# Altium schematic sheet [06] - CONNECTORS.SchDoc
size A4
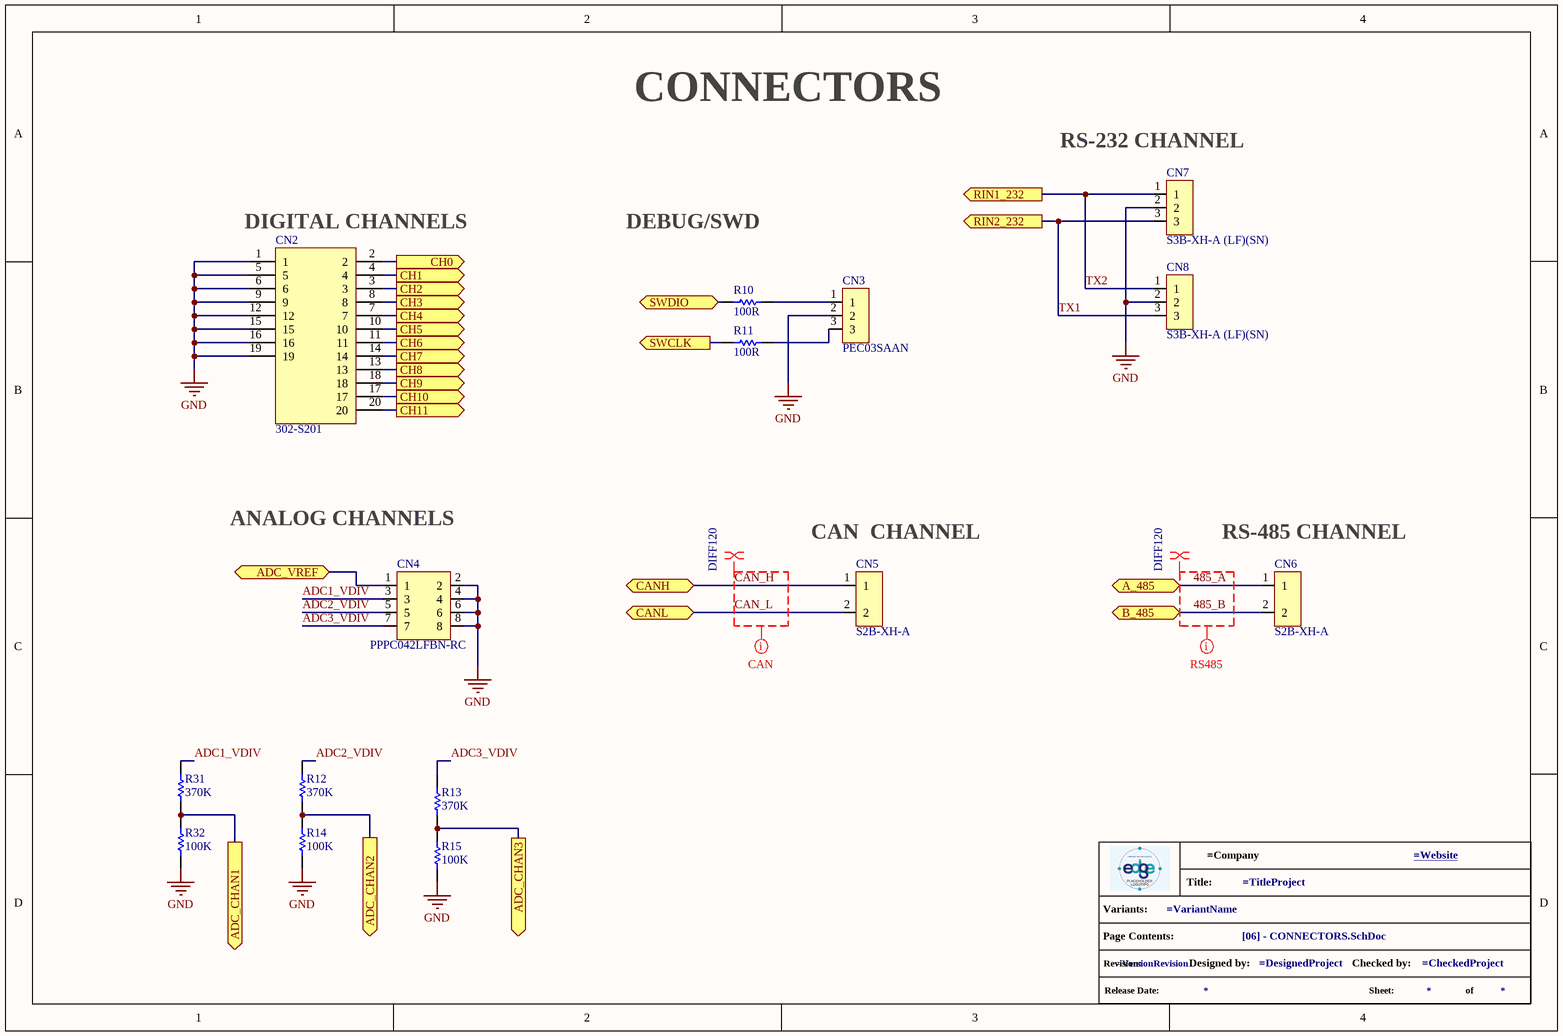
[diagram p0: [06] - CONNECTORS.SchDoc]

## Parts
CN2  302-S201  [SHDR20W66P254_2X10_3300X905X905P]
CN3  PEC03SAAN  [PEC03SAAN]
CN4  PPPC042LFBN-RC  [XPYC042LFBN-RC]
CN5  S2B-XH-A  [S2B-XH-A]
CN6  S2B-XH-A  [S2B-XH-A]
CN7  S3B-XH-A (LF)(SN)  [SHDRRA3W64P0X250_1X3_990X1150X610P]
CN8  S3B-XH-A (LF)(SN)  [SHDRRA3W64P0X250_1X3_990X1150X610P]
GPH?  info_project  (value not drawn)  (graphical)
R10  100R  [R0603]
R11  100R  [R0603]
R12  370K  [R0603]
R13  370K  [R0603]
R14  100K  [R0402]
R15  100K  [R0402]
R31  370K  [R0603]
R32  100K  [R0402]

## Ports
A_485 (bidir), ADC_CHAN1 (out), ADC_CHAN2 (out), ADC_CHAN3 (out), ADC_VREF (bidir), B_485 (bidir), CANH (bidir), CANL (bidir), CH0 (out), CH1 (out), CH2 (out), CH3 (out), CH4 (out), CH5 (out), CH6 (out), CH7 (out), CH8 (out), CH9 (out), CH10 (out), CH11 (out), RIN1_232 (out), RIN2_232 (out), SWCLK (out), SWDIO (bidir)

## Nets
GND: CN2.1 CN2.5 CN2.6 CN2.9 CN2.12 CN2.15 CN2.16 CN2.19 CN3.2 CN4.2 CN4.4 CN4.6 CN4.8 CN7.2 CN8.2 R14.1 R15.2 R32.1
485_A: CN6.1 ; port A_485
485_B: CN6.2 ; port B_485
ADC1_VDIV: CN4.3 R31.2
ADC2_VDIV: CN4.5 R12.2
ADC3_VDIV: CN4.7 R13.2
ADC_CHAN1: R31.1 R32.2 ; port ADC_CHAN1
ADC_CHAN2: R12.1 R14.2 ; port ADC_CHAN2
ADC_CHAN3: R13.1 R15.1 ; port ADC_CHAN3
ADC_VREF: CN4.1 ; port ADC_VREF
CAN_H: CN5.1 ; port CANH
CAN_L: CN5.2 ; port CANL
CH0: CN2.2 ; port CH0
CH1: CN2.4 ; port CH1
CH2: CN2.3 ; port CH2
CH3: CN2.8 ; port CH3
CH4: CN2.7 ; port CH4
CH5: CN2.10 ; port CH5
CH6: CN2.11 ; port CH6
CH7: CN2.14 ; port CH7
CH8: CN2.13 ; port CH8
CH9: CN2.18 ; port CH9
CH10: CN2.17 ; port CH10
CH11: CN2.20 ; port CH11
SWCLK: R11.1 ; port SWCLK
SWDIO: R10.1 ; port SWDIO
TX1: CN7.3 CN8.3 ; port RIN2_232
TX2: CN7.1 CN8.1 ; port RIN1_232
NetCN3_1: CN3.1 R10.2
NetCN3_3: CN3.3 R11.2

## Layout directives
net class CAN: CAN_H, CAN_L
differential pair; differential pair class DIFF120: 485_A, 485_B, CAN_H, CAN_L
net class RS485: 485_A, 485_B

## Notes on the sheet
- CONNECTORS
- (near CN7) RS-232 CHANNEL
- (near CN2) DIGITAL CHANNELS
- DEBUG/SWD
- ANALOG CHANNELS
- (near CN5) CAN  CHANNEL
- (near CN6) RS-485 CHANNEL
- (in symbol info_project) Title:; Variants:; Page Contents:; Revision:; Designed by:; Checked by:; Release Date:; Sheet:; of

## Library data of the parts
CN2 = 302-S201: CONN - Connector Header Through Hole 20 position 0.100" (2.54mm); Manufacturer 1: On Shore Technology Inc.; Description: Conn Shrouded Header HDR 20 POS 2.54mm Solder ST Thru-Hole; .Mounting: PTH; Datasheet Link: https://www.on-shore.com/wp-content/uploads/2018/04/302-SXX1.pdf; Height: 9.05mm; Arrow Part Number: 302-S201; Arrow Price/Stock: https://www.arrow.com/en/products/302-s201/on-shore-technology?region=nac; Manufacturer Part Number 1: 302-S201; .SCHChecked: *; .PCBChecked: *
CN3 = PEC03SAAN: CONN - 3 Position connector Header Through Hole  0.100" (2.54mm); Manufacturer 1: Sullins; .Mounting: PTH; Datasheet Link: https://s3.amazonaws.com/catalogspreads-pdf/PAGE112-113%20.100%20MALE%20HDR.pdf; Height: 8.38mm; .PCBChecked: *; .SCHChecked: *; Manufacturer Part Number 1: PEC03SAAN
CN4 = PPPC042LFBN-RC: CONN - 8 Position Header Connector 0.100" (2.54mm) Through Hole Gold; Manufacturer 1: Sullins; .Mounting: PTH; Datasheet Link: https://drawings-pdf.s3.amazonaws.com/10492.pdf; Height: 8.7mm; Manufacturer Part Number 1: PPPC042LFBN-RC; .SCHChecked: *; .PCBChecked: *
CN5 CN6 = S2B-XH-A: CONN - Connector Header Through Hole, Right Angle 2 position 0.098" (2.50mm); Manufacturer 1: JST (JAPAN SOLDERLESS TERMINALS); Manufacturer Part Number 1: S2B-XH-A-1(LF)(SN); .Mounting: PTH; Datasheet Link: http://www.jst-mfg.com/product/pdf/eng/eXH.pdf; Height: 6.1mm; Mouser Part Number: 306-S2BXHA1LFSN; Mouser Price/Stock: https://www.mouser.co.uk/ProductDetail/JST-Commercial/S2B-XH-A-1LFSN?qs=QpmGXVUTftHhNeC%252BPQWeTw%3D%3D; .PCBChecked: *; .SCHChecked: *
CN7 CN8 = S3B-XH-A (LF)(SN): CONN - Connector Header Through Hole, Right Angle 3 position 0.098" (2.50mm); Manufacturer 1: JST (JAPAN SOLDERLESS TERMINALS); .Mounting: PTH; Datasheet Link: http://www.farnell.com/datasheets/2057209.pdf; Height: 6.1mm; Manufacturer Part Number 1: S3B-XH-A; .SCHChecked: *; .PCBChecked: *
GPH? = info_project: GRAPHICAL - Info Project
R10 R11 = CRCW0603100RJNEAHP: RES - 100R  1/3W 0603 (1608 Metric) ±5%; Manufacturer 1: Vishay Dale; Power: 250mW; Rated Temperature: 70°C; Working Voltage: 75V; Temperature Coefficient (ppm/Cel): 200; Package Height: 0.45mm; Package Length: 1.6mm; Package Width: 0.85mm; Reference Standard: AEC-Q200; .Mounting: SMT; Supplier: Digikey; Supplier Part Number: 541-100SACT-ND; Manufacturer Part Number 1: CRCW0603100RJNEAHP; RoHS: Yes; Category: Chip SMD Resistors; Stock: 18342; Pricing: 1=0,14, 10=0,07, 50=0,0458, 100=0,0388, 500=0,02794, 1000=0,0248 (USD); Mounting Technology: Surface Mount; Pins: 2; Package Shape: Rectangular; Case/Package: 0603; Terminal Finish: Nickel; Min Operating Temperature: -55°C; Max Operating Temperature: 155°C; Tolerance: 5%; JESD-609 Code: e3; Resistor Type: FIXED RESISTOR; Construction: Chip; Packaging: Tape and Reel; Value: 100R; Technology: METAL GLAZE/THICK FILM; Termination: Wraparound; Reach SVHC Compliant: Yes; RoHS Compliant: Yes; ComponentLink1URL: https://datasheet.ciiva.com:443/pdfs/VipMasterIC/IC/VISH/VISH-S-A0009391795/VISH-S-A0009391795-1.pdf?src-supplier=IHS+Markit; ComponentLink1Description: https://datasheet.ciiva.com:443/pdfs/VipMasterIC/IC/VISH/VISH-S-A0009391795/VISH-S-A0009391795-1.pdf?src-supplier=IHS+Markit; ComponentLink2URL: https://datasheet.ciiva.com/8979/crcwhpe3-8979829.pdf?src-supplier=Avnet; ComponentLink2Description: https://datasheet.ciiva.com/8979/crcwhpe3-8979829.pdf?src-supplier=Avnet; ComponentLink3URL: https://datasheet.ciiva.com/5562/crcwhpe3-46056-5562229.pdf?src-supplier=Mouser; ComponentLink3Description: https://datasheet.ciiva.com/5562/crcwhpe3-46056-5562229.pdf?src-supplier=Mouser; .PCBChecked: *; .SCHChecked: *
R12 R13 R31 = RN73H1JTTD3703F100: RES - 370K  0.1W  0603 1% 75V Fixed Resistor, Thin Film; Manufacturer 1: KOA Speer; .Mounting: SMT; Supplier: Digikey; Supplier Part Number: 2019-RN73H1JTTD3703F100CT-ND; RoHS: Yes; Category: Chip SMD Resistors; Stock: 2861; Pricing: 1=0,12, 10=0,103, 50=0,0898, 100=0,0849, 500=0,07462, 1000=0,0708 (USD); ComponentLink1URL: https://datasheet.ciiva.com:443/pdfs/VipMasterIC/IC/KOAS/KOAS-S-A0009586296/KOAS-S-A0009586296-1.pdf?src-supplier=IHS+Markit; ComponentLink1Description: https://datasheet.ciiva.com:443/pdfs/VipMasterIC/IC/KOAS/KOAS-S-A0009586296/KOAS-S-A0009586296-1.pdf?src-supplier=IHS+Markit; ComponentLink2URL: http://www.mouser.com/ds/2/219/RN73H-12200.pdf?src-supplier=Mouser; ComponentLink2Description: http://www.mouser.com/ds/2/219/RN73H-12200.pdf?src-supplier=Mouser; .PCBChecked: *; .SCHChecked: *; Value: 370K; Manufacturer Part Number 1: RN73H1JTTD3703F100
R14 R15 R32 = RC0402JR-07100KL: RES - 100K  0.0625W 0402 5% 50V Fixed Resistor; Manufacturer 1: Yageo; Additional Feature: LASER TRIMMABLE; Power: 62.5mW; Rated Temperature: 70°C; Value: 100kR; Temperature Coefficient (ppm/Cel): 100; Package Height: 0.35mm; Package Length: 1mm; Package Width: 0.5mm; .Mounting: SMT; Supplier: Digikey; Supplier Part Number: 311-100KJRCT-ND; RoHS: Yes; Category: Chip SMD Resistors; Stock: 5514863; Pricing: 1=0,1, 10=0,006, 50=0,0056, 100=0,0051, 500=0,00408, 1000=0,00284 (USD); Mounting Technology: Surface Mount; Pins: 2; Package Shape: Rectangular; Case/Package: 0402; Terminal Finish: Nickel; Min Operating Temperature: -55°C; Max Operating Temperature: 155°C; Tolerance: 5%; JESD-609 Code: e3; Resistor Type: FIXED RESISTOR; Construction: Chip; Packaging: Tape and Reel; Technology: METAL GLAZE/THICK FILM; Termination: Wraparound; Working Voltage: 50V; Reach SVHC Compliant: Yes; RoHS Compliant: Yes; ComponentLink1URL: https://datasheet.ciiva.com:443/pdfs/VipMasterIC/IC/YAGO/YAGO-S-A0008145938/YAGO-S-A0008145938-1.pdf?src-supplier=IHS+Markit; ComponentLink1Description: https://datasheet.ciiva.com:443/pdfs/VipMasterIC/IC/YAGO/YAGO-S-A0008145938/YAGO-S-A0008145938-1.pdf?src-supplier=IHS+Markit; ComponentLink2URL: https://datasheet.ciiva.com/2491/pyu-r-int-thick-7-2491207.pdf?src-supplier=Digikey; ComponentLink2Description: https://datasheet.ciiva.com/2491/pyu-r-int-thick-7-2491207.pdf?src-supplier=Digikey; ComponentLink3URL: https://datasheet.ciiva.com/2491/pyu-r-int-thick-7-2491208.pdf?src-supplier=Digikey; ComponentLink3Description: https://datasheet.ciiva.com/2491/pyu-r-int-thick-7-2491208.pdf?src-supplier=Digikey; ComponentLink4URL: https://datasheet.ciiva.com/2491/pyu-r-int-thick-7-2491209.pdf?src-supplier=Digikey; ComponentLink4Description: https://datasheet.ciiva.com/2491/pyu-r-int-thick-7-2491209.pdf?src-supplier=Digikey; ComponentLink5URL: https://datasheet.ciiva.com/17052/pyu-rc0402-51-rohs-l-6-r-17052137.pdf?src-supplier=Future+Electronics; ComponentLink5Description: https://datasheet.ciiva.com/17052/pyu-rc0402-51-rohs-l-6-r-17052137.pdf?src-supplier=Future+Electronics; ComponentLink6URL: https://datasheet.ciiva.com/12668/pyu-rc0402-51-rohs-l-6-r-12668218.pdf?src-supplier=Mouser; ComponentLink6Description: https://datasheet.ciiva.com/12668/pyu-rc0402-51-rohs-l-6-r-12668218.pdf?src-supplier=Mouser; ComponentLink7URL: https://datasheet.ciiva.com/46394/1018594-46394941.pdf?src-supplier=Element14; ComponentLink7Description: https://datasheet.ciiva.com/46394/1018594-46394941.pdf?src-supplier=Element14; ComponentLink8URL: https://datasheet.ciiva.com/7850/1018594-7850133.pdf?src-supplier=Element14; ComponentLink8Description: https://datasheet.ciiva.com/7850/1018594-7850133.pdf?src-supplier=Element14; .PCBChecked: *; .SCHChecked: *; Manufacturer Part Number 1: RC0402JR-07100KL